# EasyEDA schematic 1-Schematic_PiHexaSub.json
TITLE: Sheet_2; REV: 1.0; Date: 2021-09-24; Sheet: 1/1; Drawn By: LeeSophia; Company: Your Company
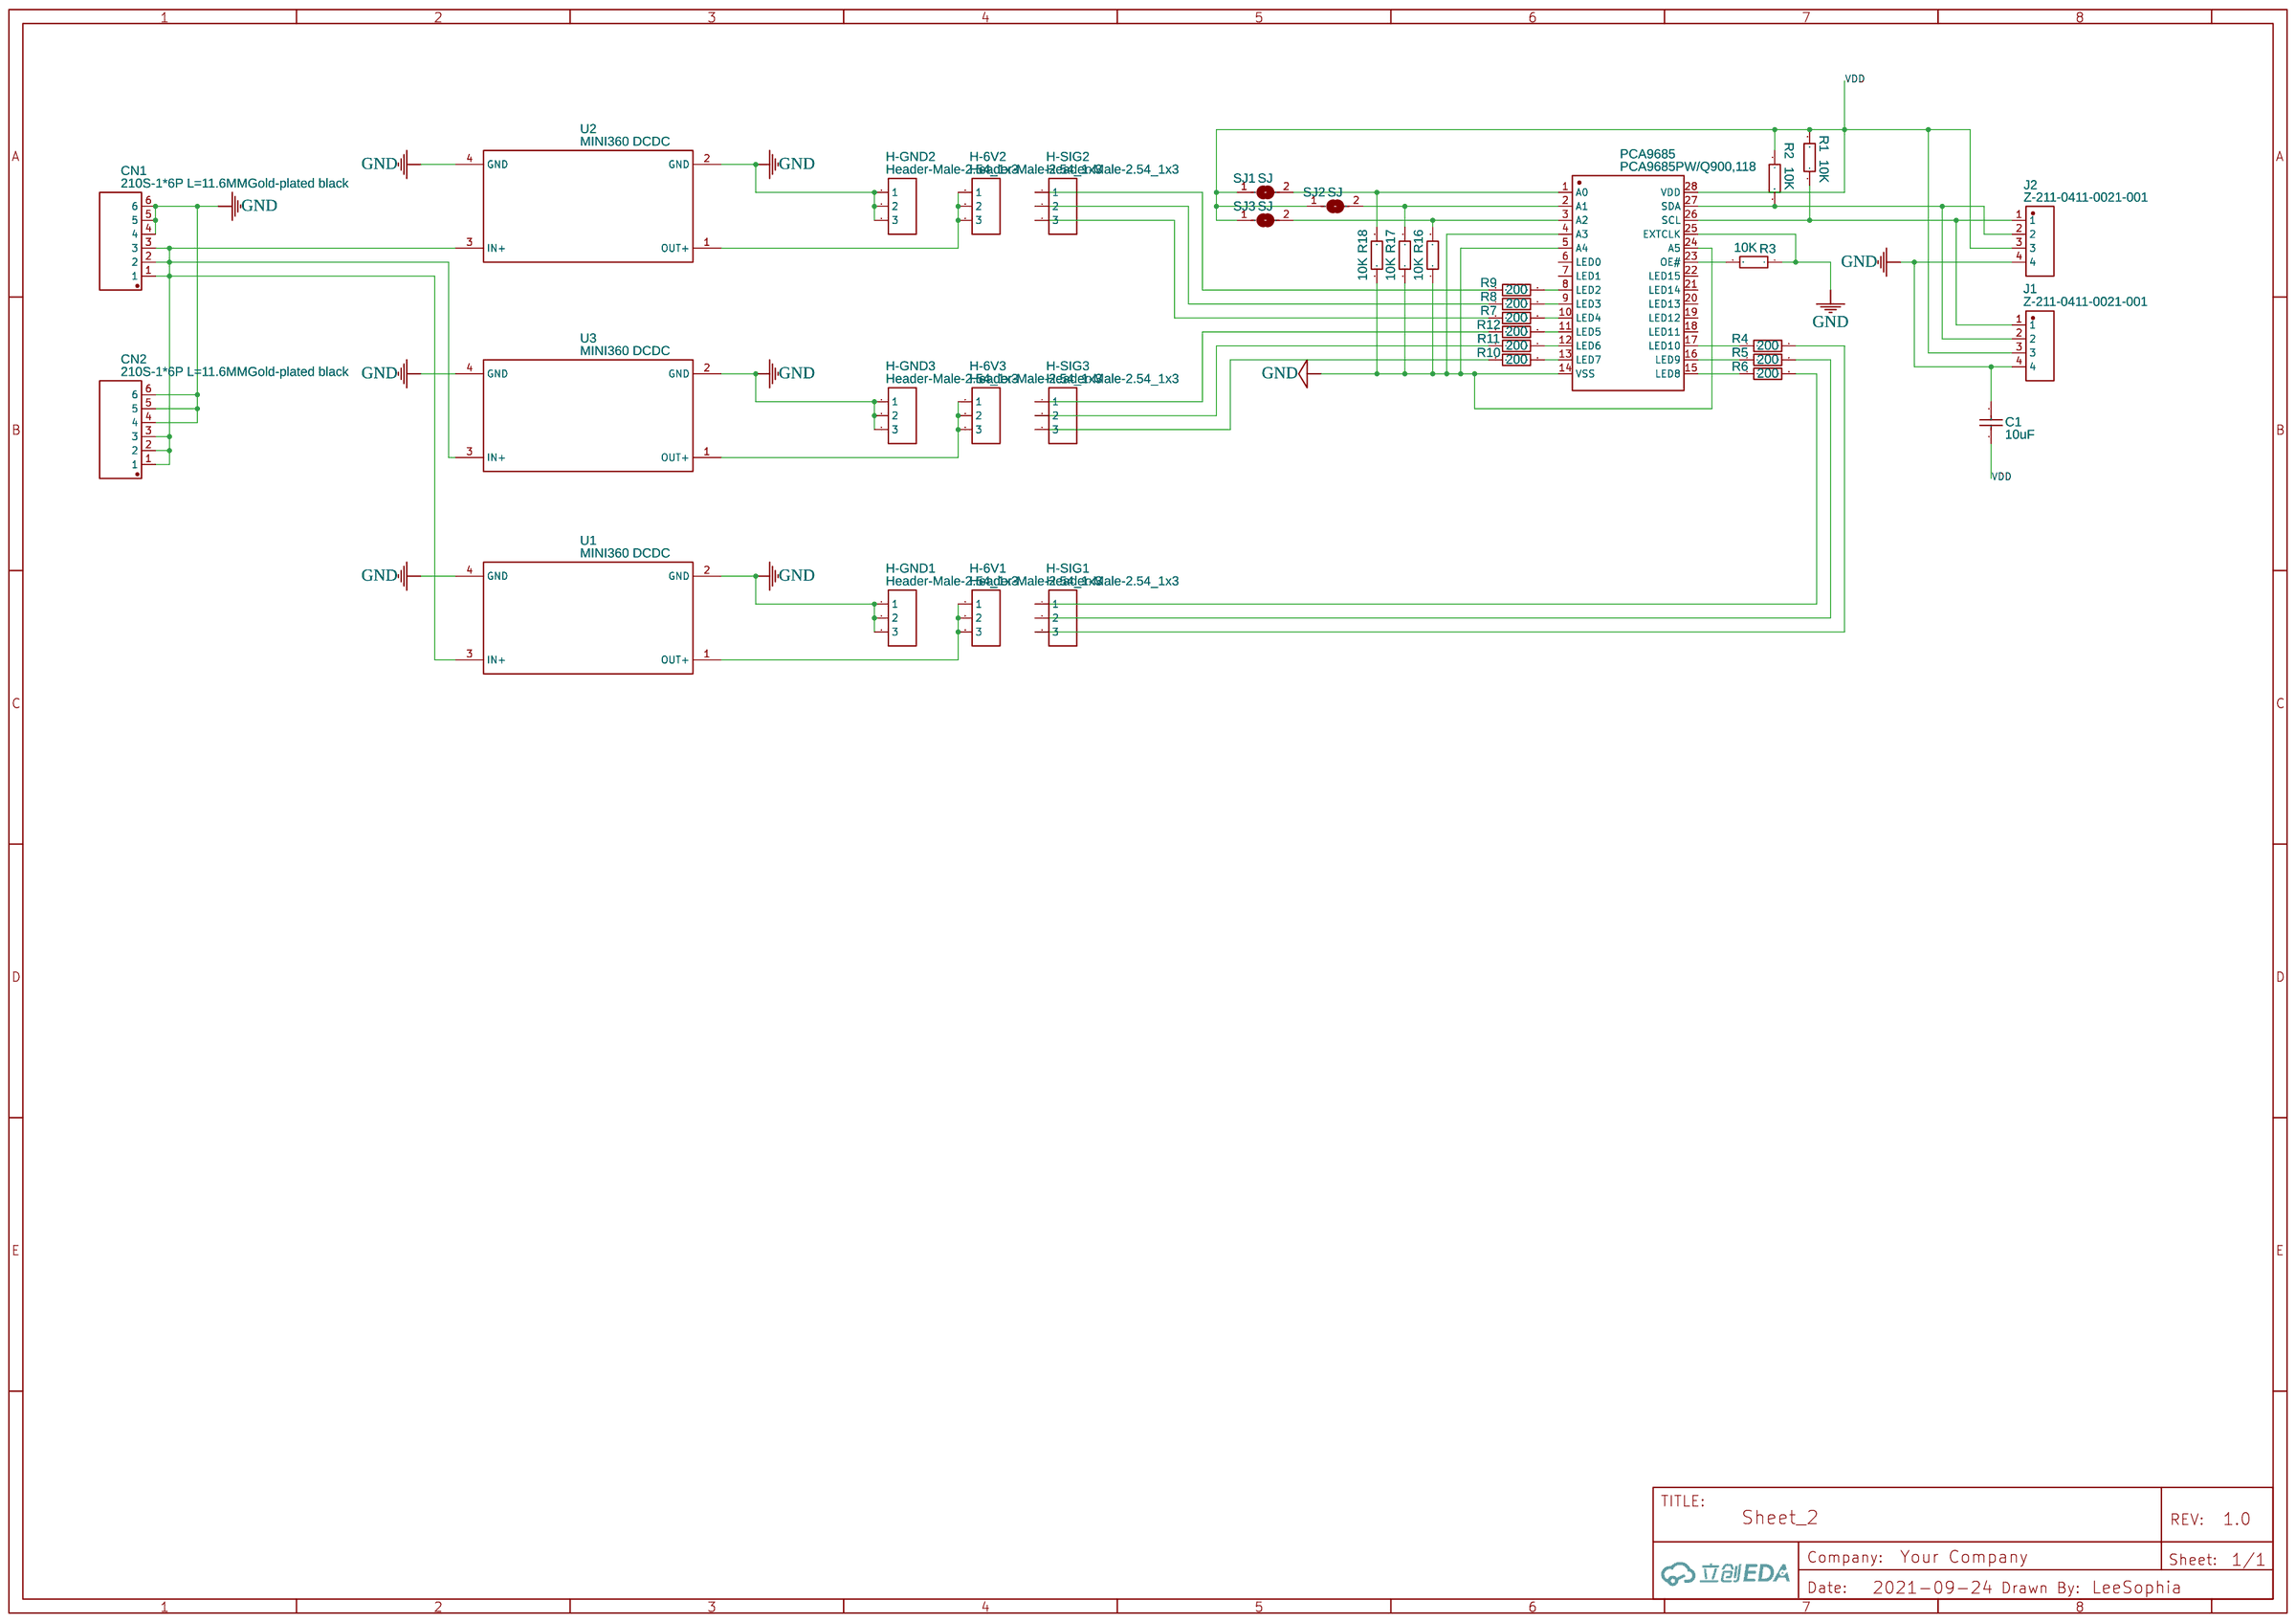
[diagram p0: schematic sheet]

## Parts
C1  10uF  [C0805]
CN1  210S-1*6P L=11.6MMGold-plated black  [HDR-TH_6P-P2.54-V_Z-211-0611-0021-001]
CN2  210S-1*6P L=11.6MMGold-plated black  [HDR-TH_6P-P2.54-V_Z-211-0611-0021-001]
H-6V1  Header-Male-2.54_1x3  [HDR-TH_3P-P2.54-V-M-1]
H-6V2  Header-Male-2.54_1x3  [HDR-TH_3P-P2.54-V-M-1]
H-6V3  Header-Male-2.54_1x3  [HDR-TH_3P-P2.54-V-M-1]
H-GND1  Header-Male-2.54_1x3  [HDR-TH_3P-P2.54-V-M-1]
H-GND2  Header-Male-2.54_1x3  [HDR-TH_3P-P2.54-V-M-1]
H-GND3  Header-Male-2.54_1x3  [HDR-TH_3P-P2.54-V-M-1]
H-SIG1  Header-Male-2.54_1x3  [HDR-TH_3P-P2.54-V-M-1]
H-SIG2  Header-Male-2.54_1x3  [HDR-TH_3P-P2.54-V-M-1]
H-SIG3  Header-Male-2.54_1x3  [HDR-TH_3P-P2.54-V-M-1]
J1  Z-211-0411-0021-001  [HDR-TH_4P-P2.54-V-M]
J2  Z-211-0411-0021-001  [HDR-TH_4P-P2.54-V-M]
PCA9685  PCA9685PW/Q900,118  [TSSOP-28_L9.7-W4.4-P0.65-LS6.4-BL]
R1  10K  [R0603]
R2  10K  [R0603]
R3  10K  [R0603]
R4  200  [R0603]
R5  200  [R0603]
R6  200  [R0603]
R7  200  [R0603]
R8  200  [R0603]
R9  200  [R0603]
R10  200  [R0603]
R11  200  [R0603]
R12  200  [R0603]
R16  10K  [R0603]
R17  10K  [R0603]
R18  10K  [R0603]
SJ1  SJ  [SJ]
SJ2  SJ  [SJ]
SJ3  SJ  [SJ]
U1  MINI360 DCDC  [MINI360]
U2  MINI360 DCDC  [MINI360]
U3  MINI360 DCDC  [MINI360]

## Library data of the parts
C1 = C2012X5R1E106KT000N: Supplier: LCSC; Supplier Part: C329933; Manufacturer: TDK; Contributor: LCSC; JLCPCB Part Class: Extended Part
CN1 CN2 = 210S-1*6P L=11.6MMGold-plated black: Supplier: LCSC; Manufacturer: Ckmtw; Contributor: LCSC; Supplier Part: C124380; JLCPCB Part Class: Extended Part
H-6V1-H-6V3 H-GND1-H-GND3 H-SIG1-H-SIG3 = Header-Male-2.54_1x3: Supplier: LCSC; Manufacturer: BOOMELE; Manufacturer Part: Header2.54mm 1*3P; Supplier Part: C49257; JLCPCB Part Class: Extended Part
J1 J2 = Z-211-0411-0021-001: Supplier: LCSC; Manufacturer: ZHENGLING; Contributor: LCSC; Supplier Part: C152150; JLCPCB Part Class: Extended Part
PCA9685 = PCA9685PW/Q900,118: Supplier: LCSC; Manufacturer: NXP; Supplier Part: C92206; JLCPCB Part Class: Extended Part
R1-R3 R16-R18 = RMCF0603JT10K0: Supplier: LCSC; Supplier Part: C238881; Manufacturer: Stackpole Elec; Contributor: LCSC; JLCPCB Part Class: Extended Part
R4-R12 = RMS06FT2000: Supplier: LCSC; Supplier Part: C209065; Manufacturer: TA-I Tech; Contributor: LCSC; JLCPCB Part Class: Extended Part
SJ1-SJ3 = SJ: Contributor: Zealot
U1-U3 = MINI360 DCDC: Contributor: libc0607

## Nets
GND: C1.1 CN1.4 CN1.5 CN1.6 CN2.4 CN2.5 CN2.6 H-GND1.1 H-GND1.2 H-GND1.3 H-GND2.1 H-GND2.2 H-GND2.3 H-GND3.1 H-GND3.2 H-GND3.3 J1.4 J2.4 PCA9685.4(A3) PCA9685.5(A4) PCA9685.14(VSS) PCA9685.24(A5) PCA9685.25(EXTCLK) R3.1 R16.1 R17.1 R18.1 U1.2(GND) U1.4(GND) U2.2(GND) U2.4(GND) U3.2(GND) U3.4(GND)
VDD: C1.2 J1.3 J2.3 PCA9685.28(VDD) R1.1 R2.1 SJ1.1 SJ2.1 SJ3.1
Net-(CN1-1): CN1.1 CN1.2 CN1.3 CN2.1 CN2.2 CN2.3 U1.3(IN+) U2.3(IN+) U3.3(IN+)
Net-(H-6V1-1): H-6V1.1 H-6V1.2 H-6V1.3 U1.1(OUT+)
Net-(H-6V2-1): H-6V2.1 H-6V2.2 H-6V2.3 U2.1(OUT+)
Net-(H-6V3-1): H-6V3.1 H-6V3.2 H-6V3.3 U3.1(OUT+)
Net-(H-SIG1-1): H-SIG1.1 R6.2
Net-(H-SIG1-2): H-SIG1.2 R5.2
Net-(H-SIG1-3): H-SIG1.3 R4.2
Net-(H-SIG2-1): H-SIG2.1 R9.1
Net-(H-SIG2-2): H-SIG2.2 R8.1
Net-(H-SIG2-3): H-SIG2.3 R7.1
Net-(H-SIG3-1): H-SIG3.1 R12.1
Net-(H-SIG3-2): H-SIG3.2 R11.1
Net-(H-SIG3-3): H-SIG3.3 R10.1
Net-(J1-1): J1.1 J2.1 PCA9685.26(SCL) R1.2
Net-(J1-2): J1.2 J2.2 PCA9685.27(SDA) R2.2
Net-(PCA9685-1): PCA9685.1(A0) R18.2 SJ1.2
Net-(PCA9685-2): PCA9685.2(A1) R17.2 SJ2.2
Net-(PCA9685-3): PCA9685.3(A2) R16.2 SJ3.2
Net-(PCA9685-8): PCA9685.8(LED2) R9.2
Net-(PCA9685-9): PCA9685.9(LED3) R8.2
Net-(PCA9685-10): PCA9685.10(LED4) R7.2
Net-(PCA9685-11): PCA9685.11(LED5) R12.2
Net-(PCA9685-12): PCA9685.12(LED6) R11.2
Net-(PCA9685-13): PCA9685.13(LED7) R10.2
Net-(PCA9685-15): PCA9685.15(LED8) R6.1
Net-(PCA9685-16): PCA9685.16(LED9) R5.1
Net-(PCA9685-17): PCA9685.17(LED10) R4.1
Net-(PCA9685-23): PCA9685.23(OE#) R3.2

Not connected (* = marked no-connect by the designer): PCA9685 6(LED0) 7(LED1) 18(LED11) 19(LED12) 20(LED13) 21(LED14) 22(LED15)
